# EasyEDA Pro project ProProject_基于STM32的Buck-Boost型数字电源_2024-06-04.epro, schematic Schematic1

## Sheets
1 P1: Create Date: 2023-12-06; Page Name: P1; Project Name: 基于STM32的Buck-Boost型数字电源; Schematic Name: Schematic1; Update Date: 2023-12-06; Company: 嘉立创EDA; Page Size: A4; Version: V1.0
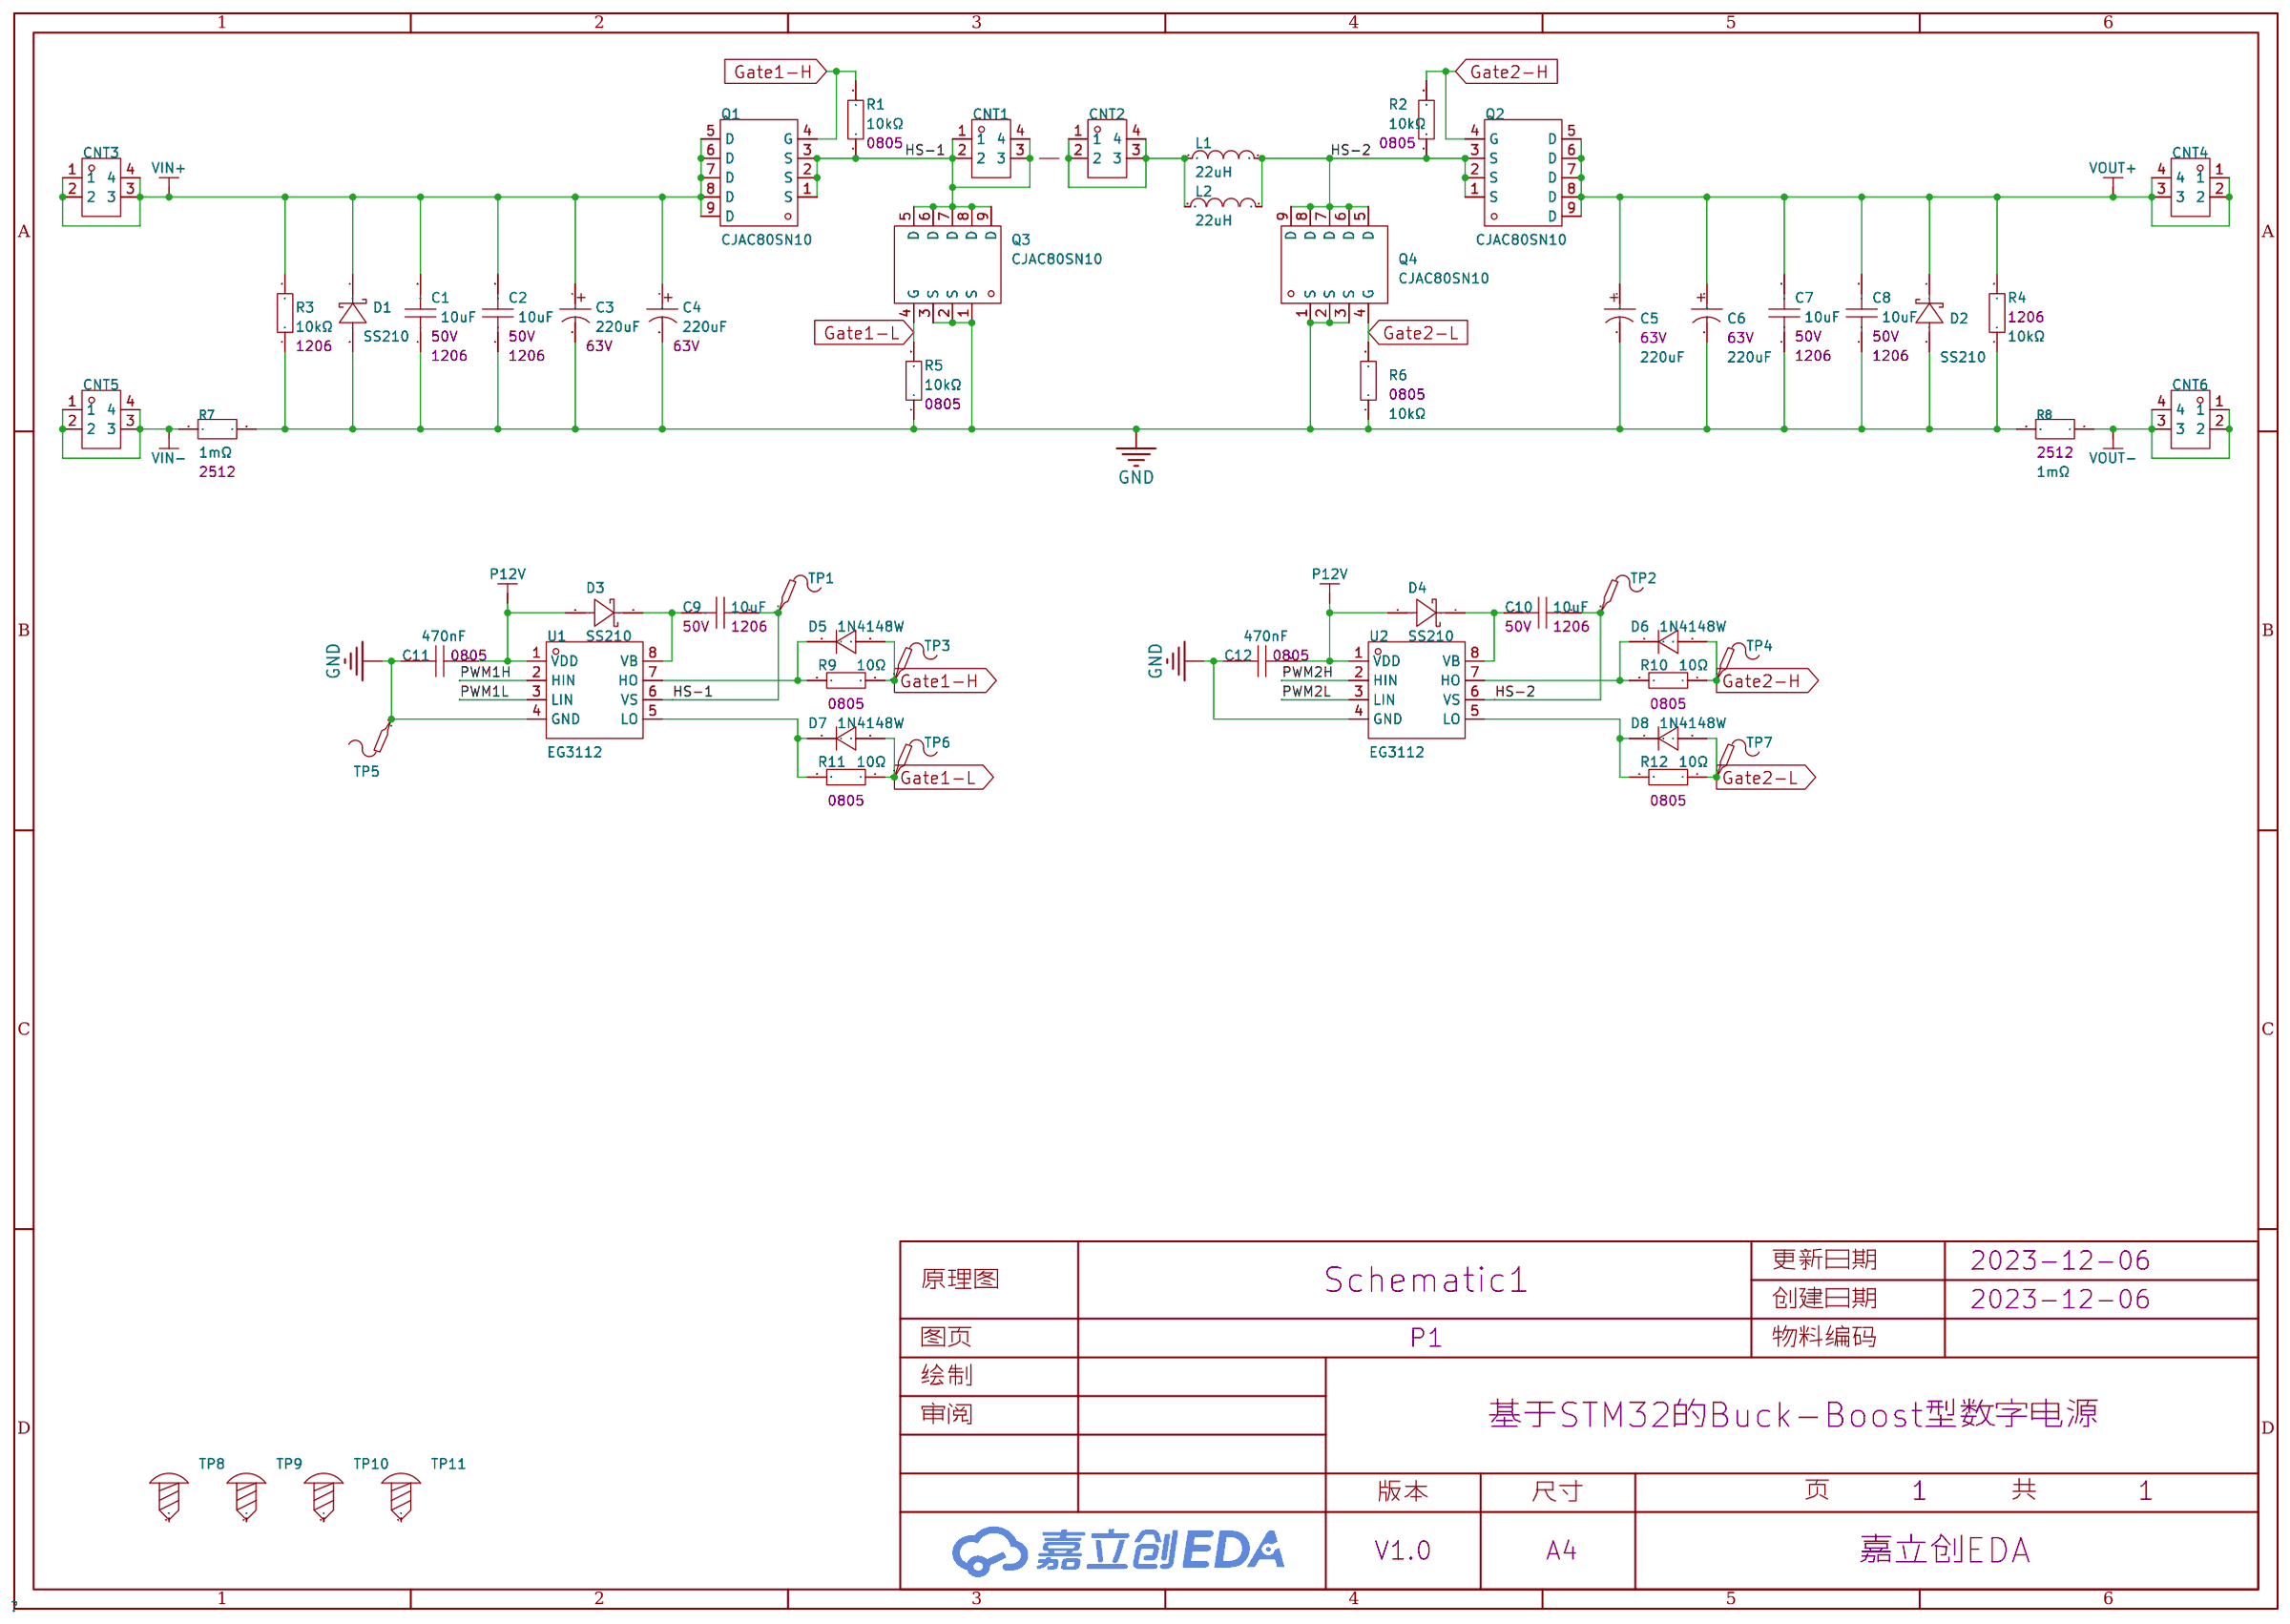
[diagram p0: P1]
2 P2: Create Date: 2024-01-31; Page Name: P2; Update Date: 2024-01-31
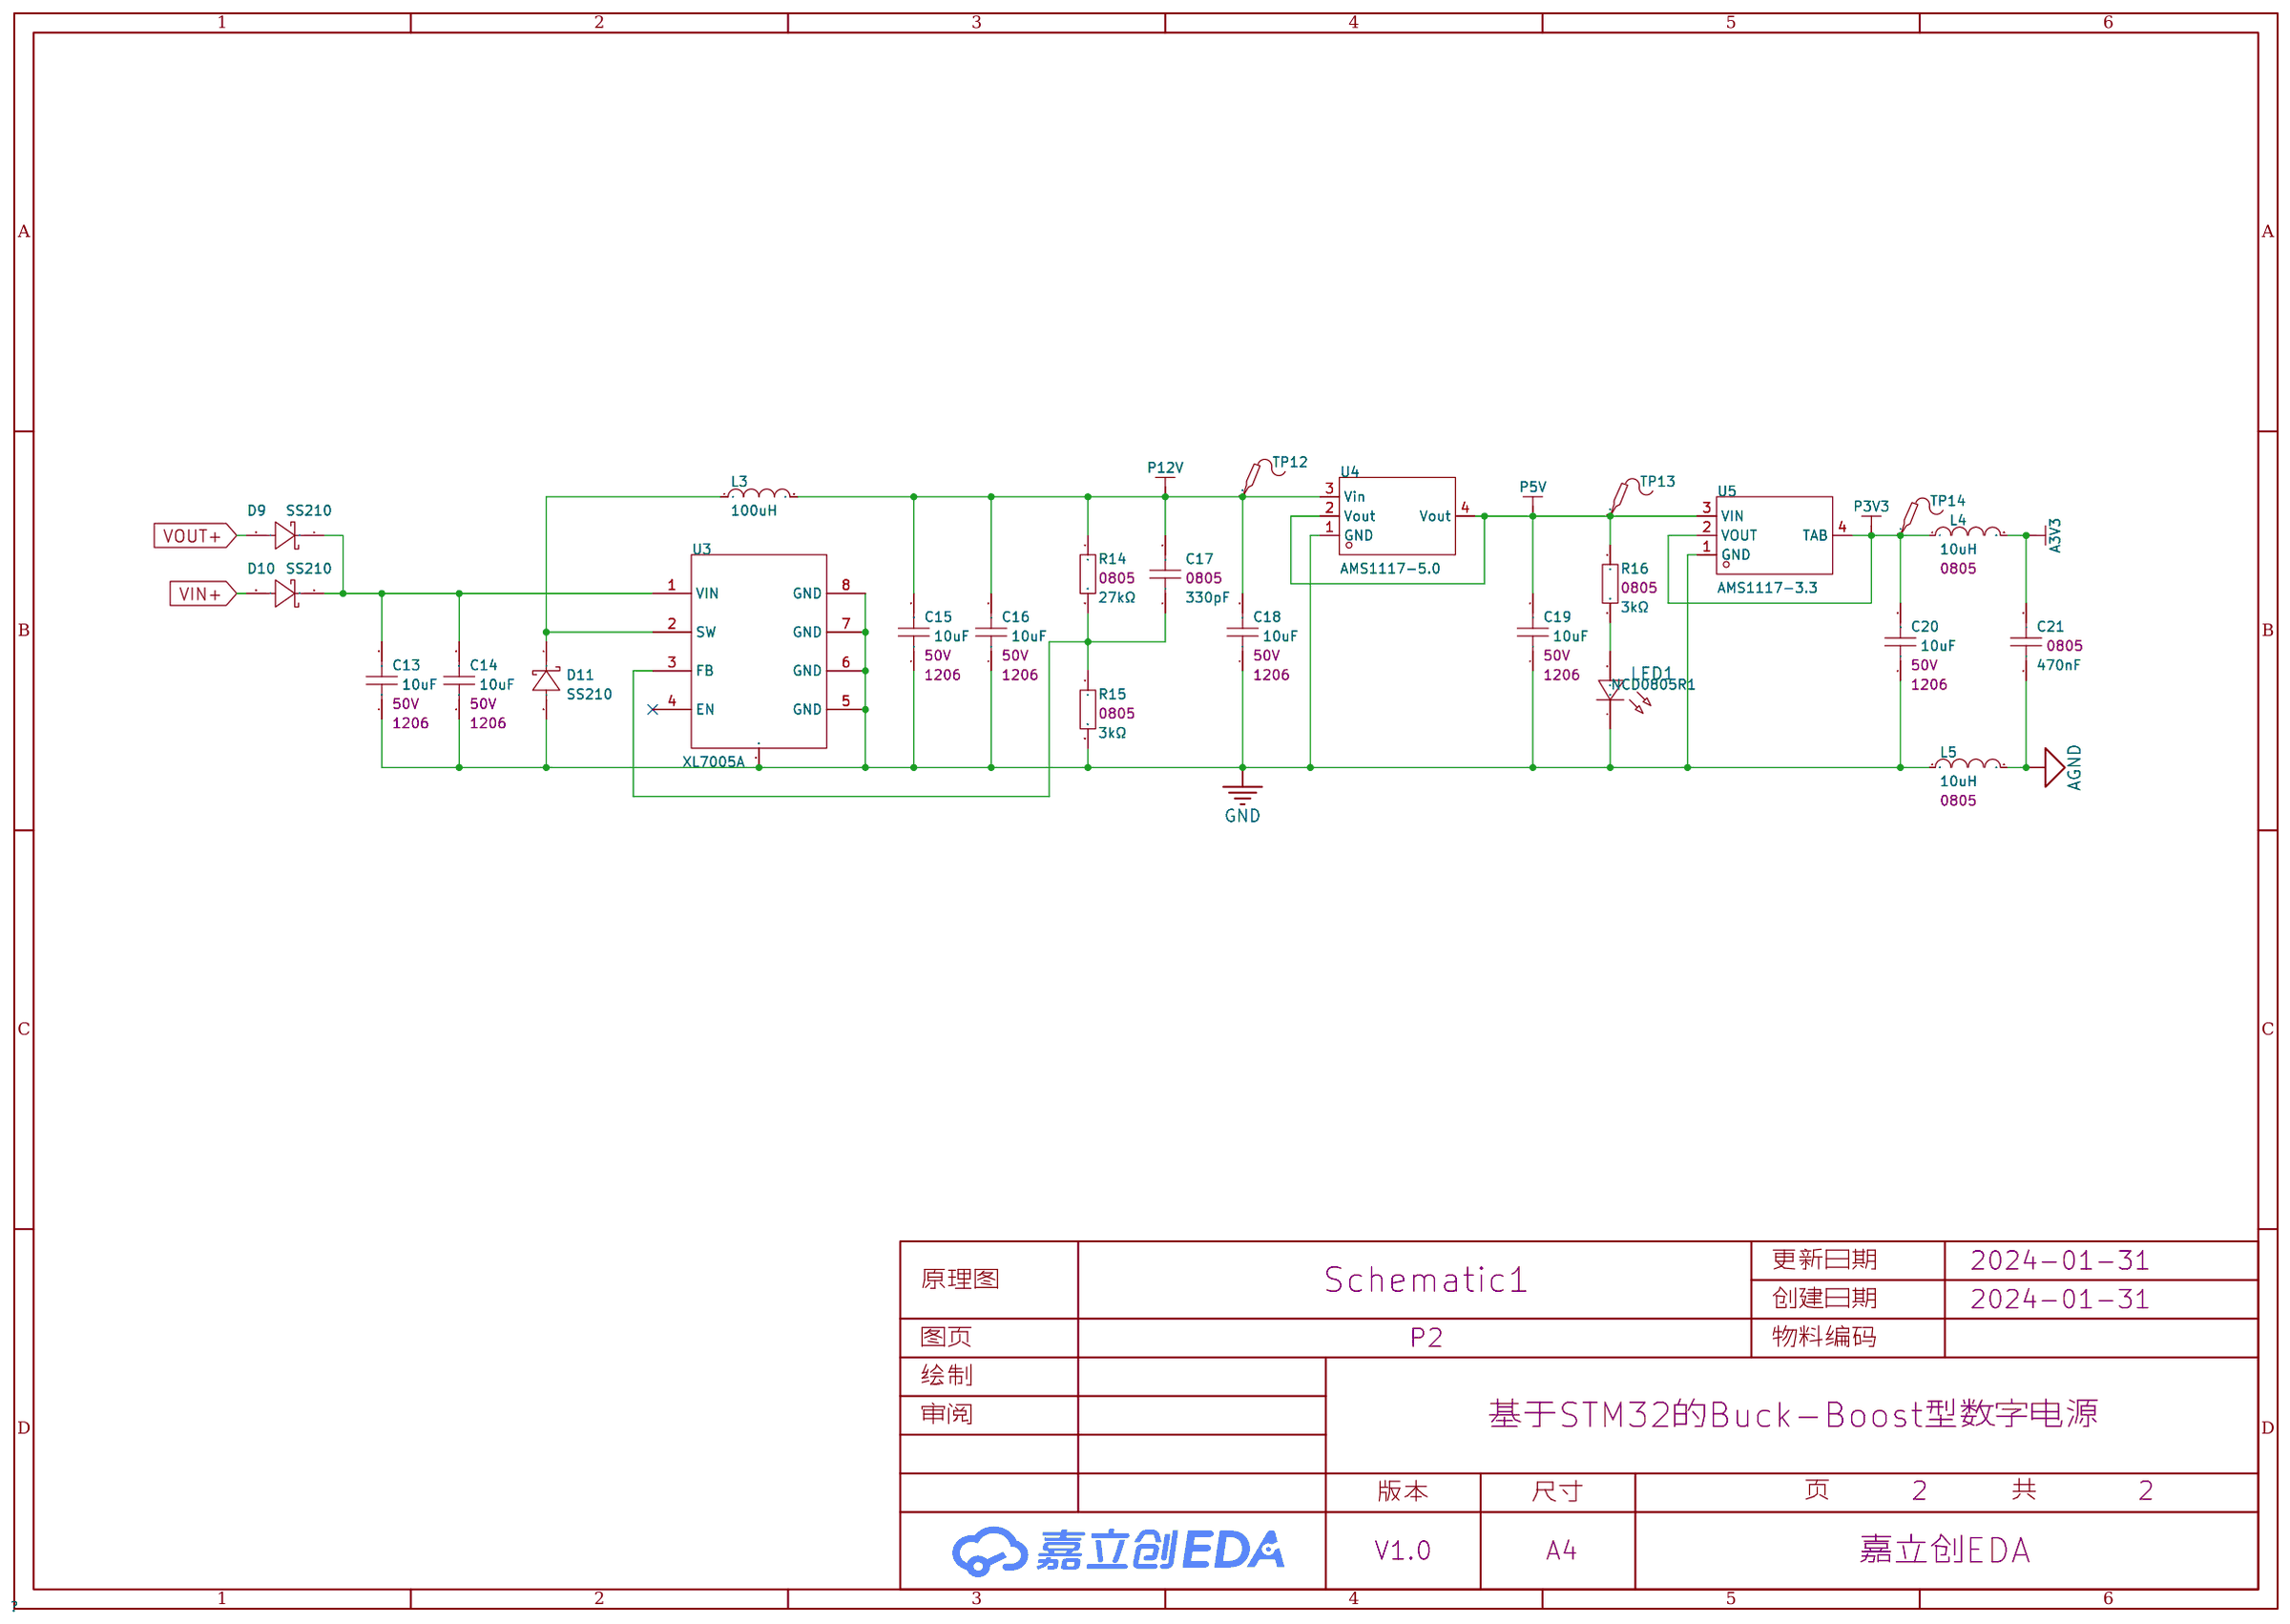
[diagram p1: P2]
3 P3: Create Date: 2024-01-31; Page Name: P3; Update Date: 2024-01-31
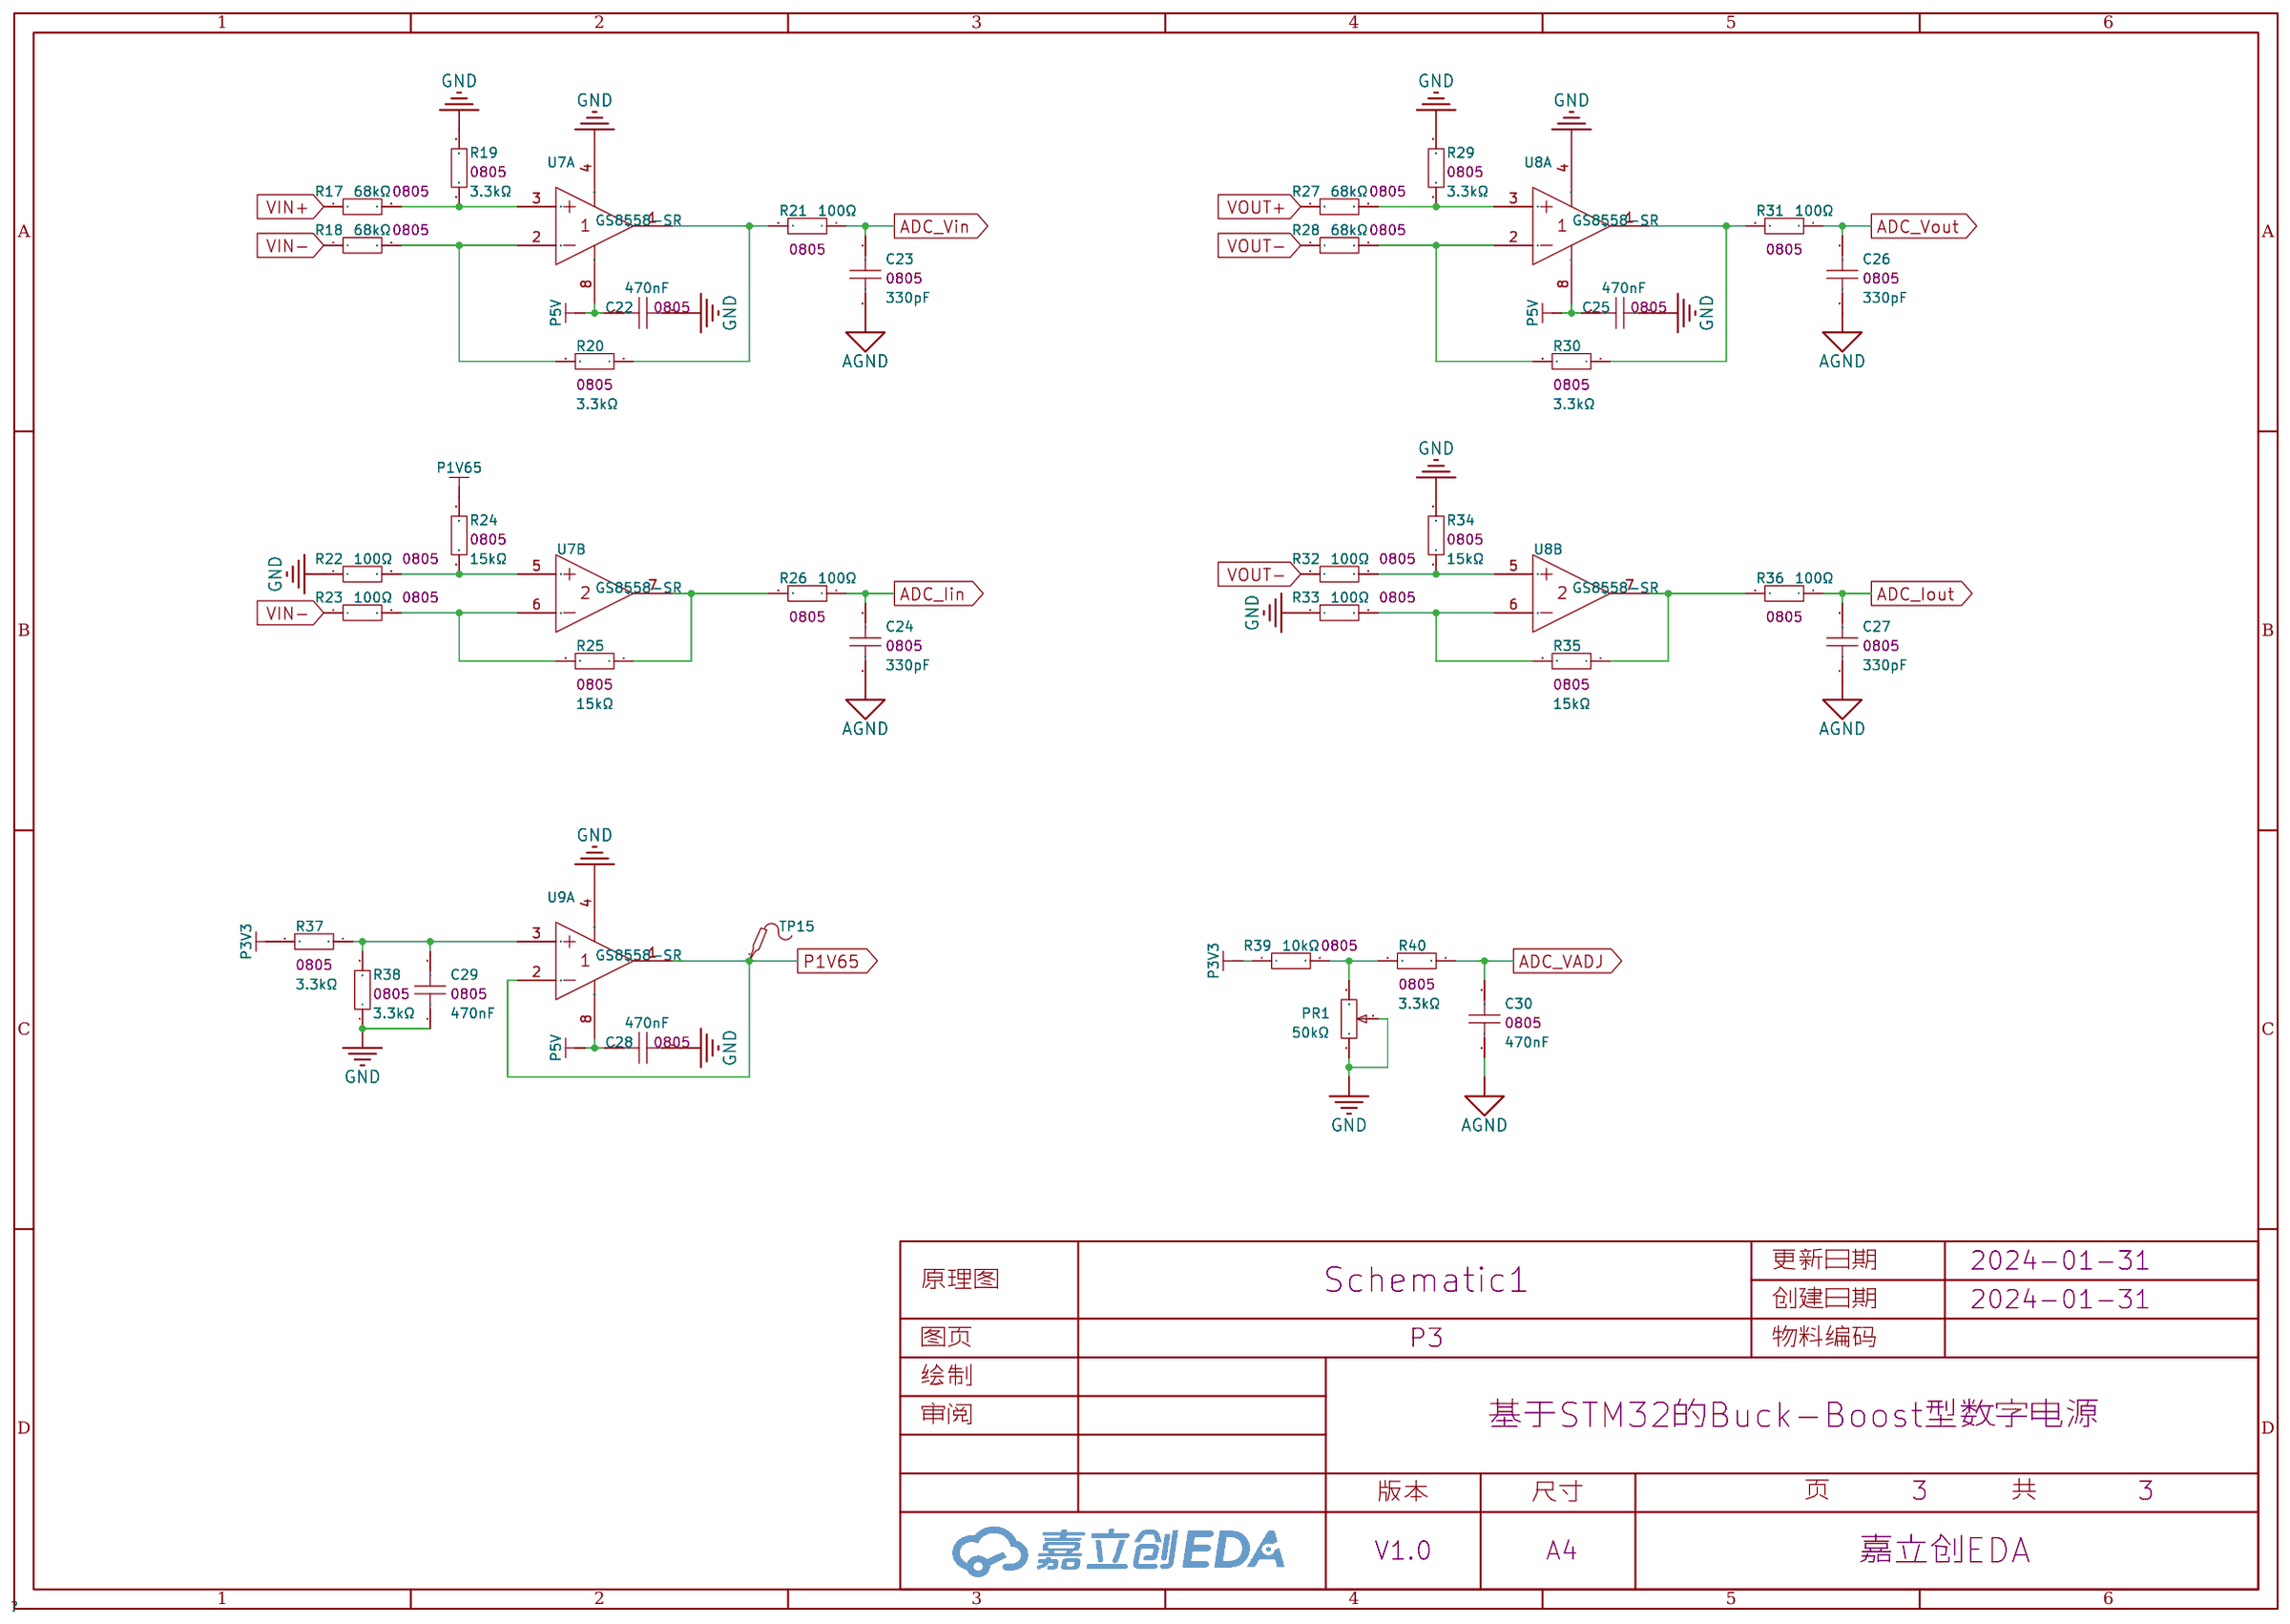
[diagram p2: P3]
4 P4: Create Date: 2024-01-31; Page Name: P4; Update Date: 2024-01-31
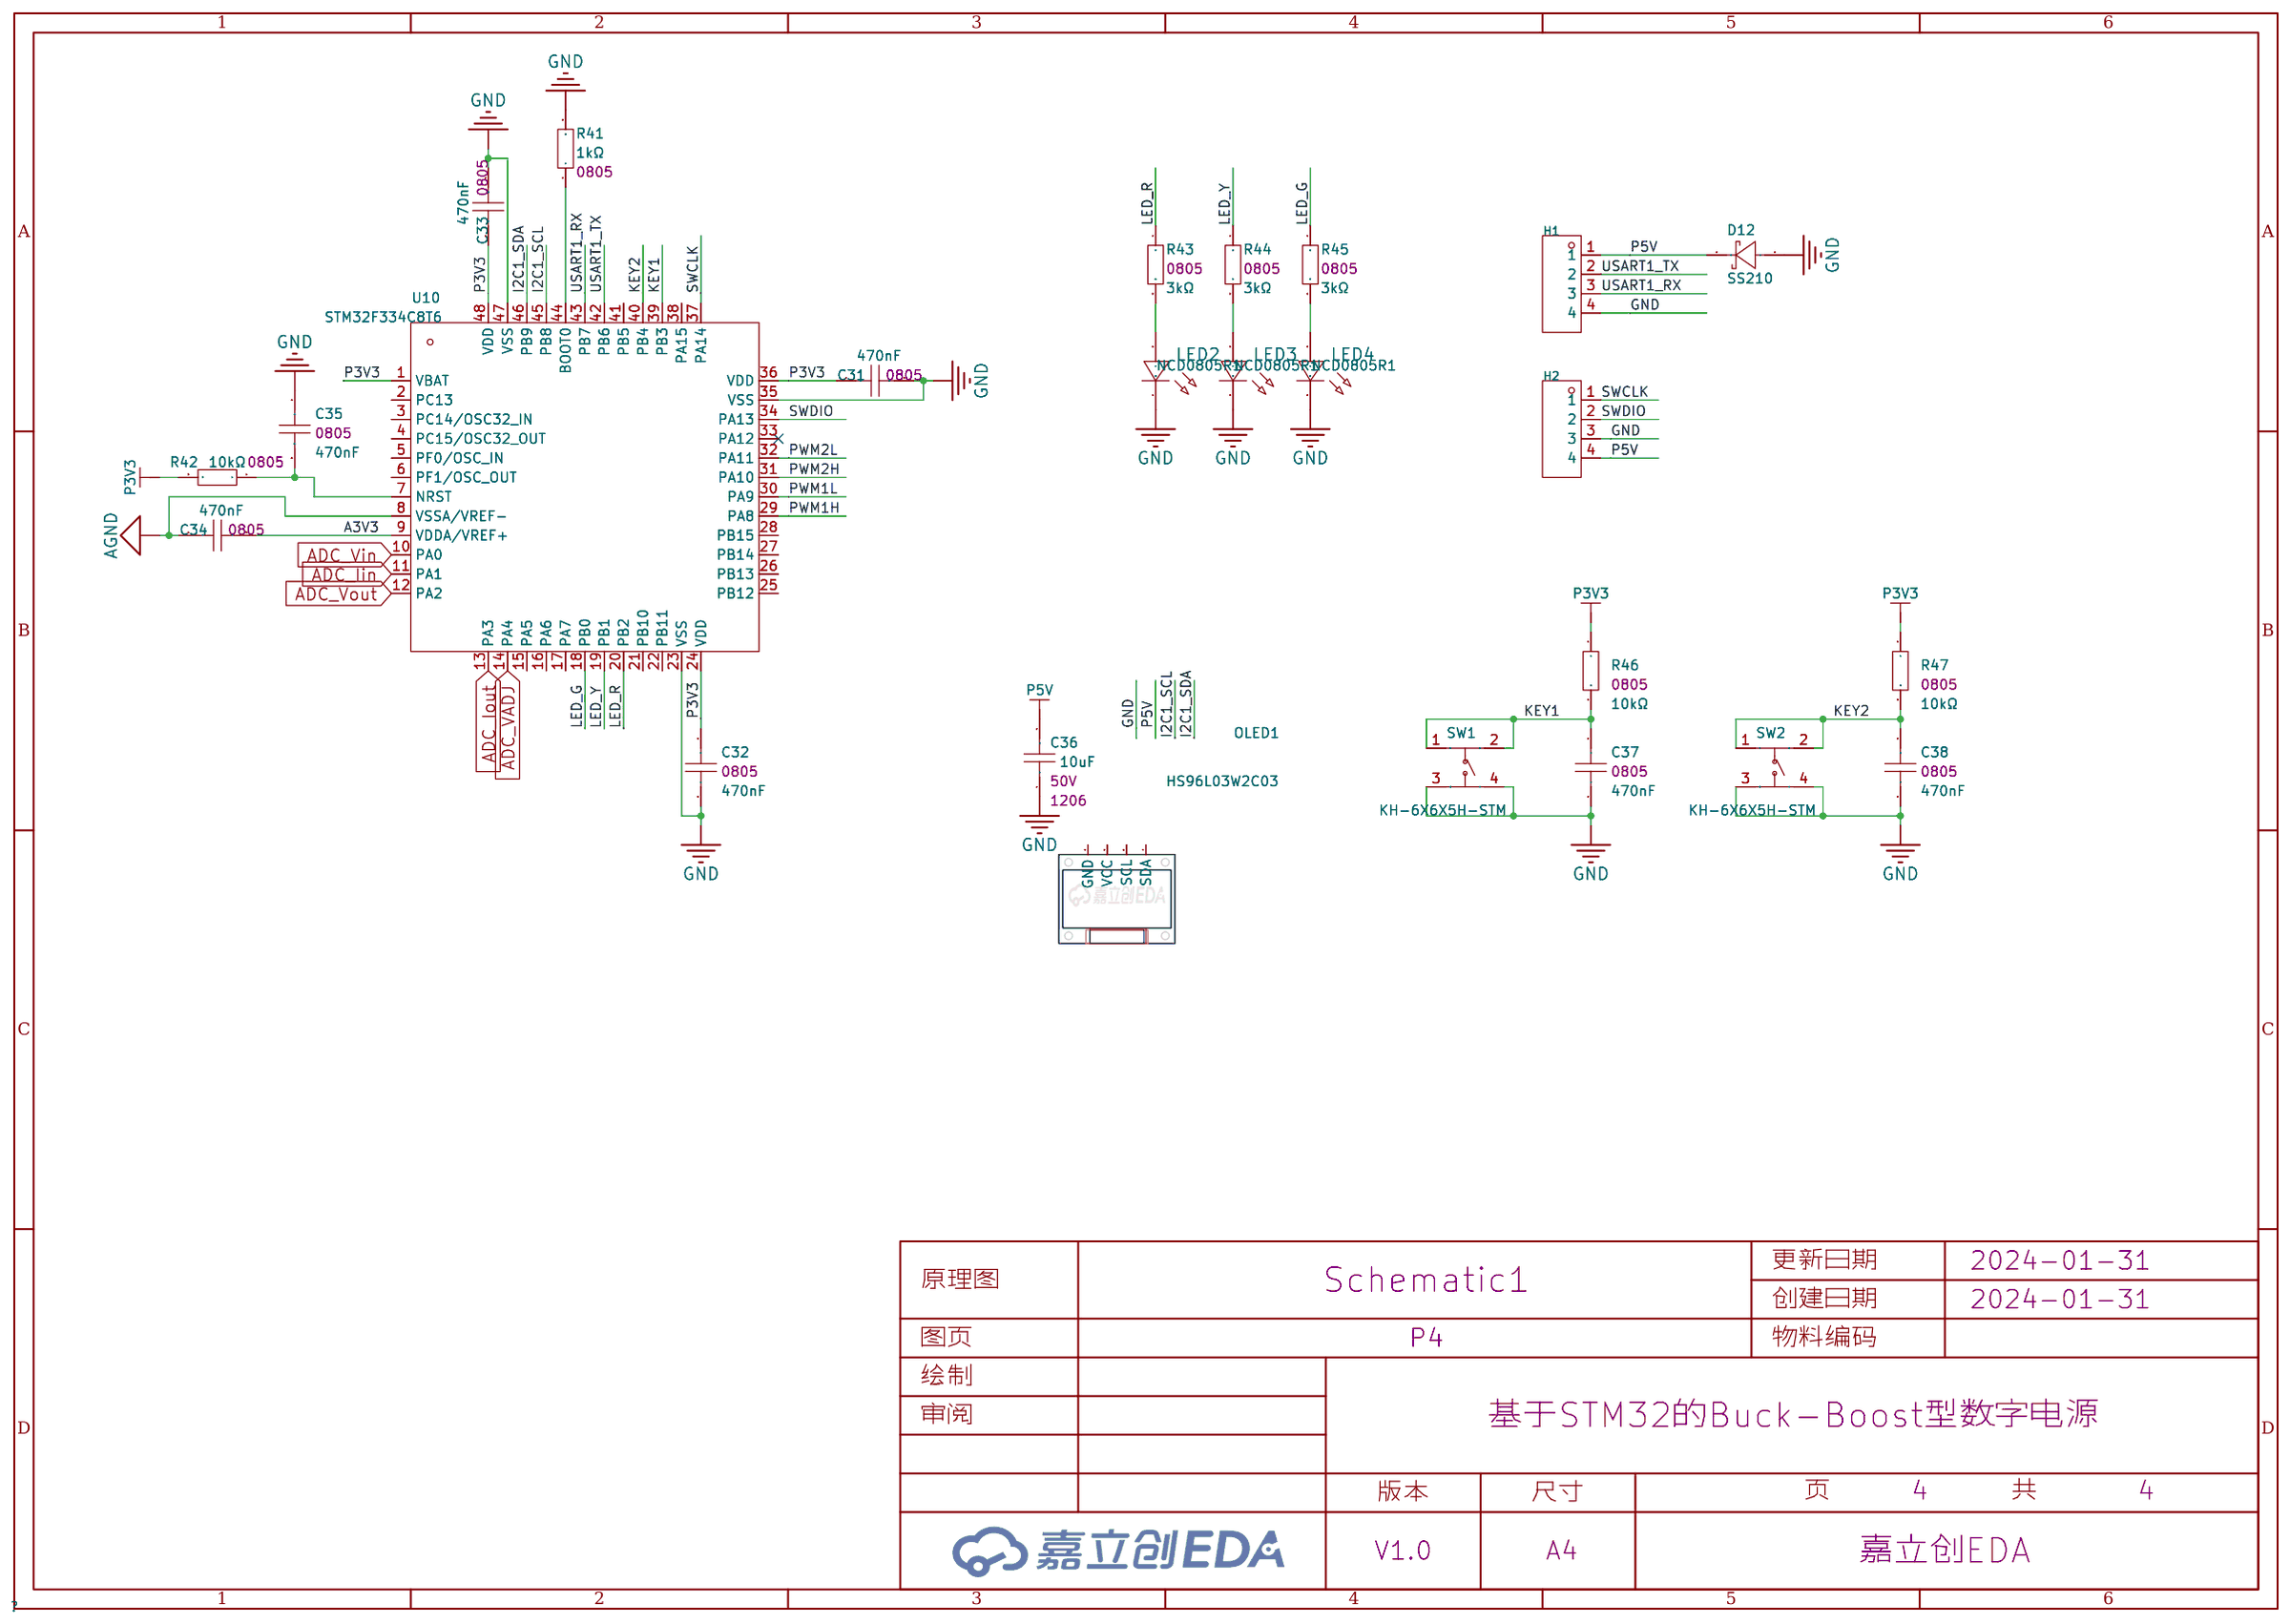
[diagram p3: P4]

## Parts
sheet P1
C1  10uF  [C1206]
C2  10uF  [C1206]
C3  220uF  [CAP-TH_BD10.0-P5.00-D1.0-FD]
C4  220uF  [CAP-TH_BD10.0-P5.00-D1.0-FD]
C5  220uF  [CAP-TH_BD10.0-P5.00-D1.0-FD]
C6  220uF  [CAP-TH_BD10.0-P5.00-D1.0-FD]
C7  10uF  [C1206]
C8  10uF  [C1206]
C9  10uF  [C1206]
C10  10uF  [C1206]
C11  470nF  [C0805]
C12  470nF  [C0805]
CNT1  T34001  [CONN-TH_T34001]
CNT2  T34001  [CONN-TH_T34001]
CNT3  T34001  [CONN-TH_T34001]
CNT4  T34001  [CONN-TH_T34001]
CNT5  T34001  [CONN-TH_T34001]
CNT6  T34001  [CONN-TH_T34001]
D1  SS210  [SMA_L4.3-W2.6-LS5.0-RD]
D2  SS210  [SMA_L4.3-W2.6-LS5.0-RD]
D3  SS210  [SMA_L4.3-W2.6-LS5.0-RD]
D4  SS210  [SMA_L4.3-W2.6-LS5.0-RD]
D5  1N4148W  [SOD-123_L2.8-W1.8-LS3.7-RD]
D6  1N4148W  [SOD-123_L2.8-W1.8-LS3.7-RD]
D7  1N4148W  [SOD-123_L2.8-W1.8-LS3.7-RD]
D8  1N4148W  [SOD-123_L2.8-W1.8-LS3.7-RD]
L1  22uH  [IND-TH_L29.0-W12.0-P10.00]
L2  22uH  [IND-SMD_L13.5-W12.6_XR_XR1265]
Q1  CJAC80SN10  [PDFN-8_L5.8-W5.0-P1.27-LS6.0-BL]
Q2  CJAC80SN10  [PDFN-8_L5.8-W5.0-P1.27-LS6.0-BL]
Q3  CJAC80SN10  [PDFN-8_L5.8-W5.0-P1.27-LS6.0-BL]
Q4  CJAC80SN10  [PDFN-8_L5.8-W5.0-P1.27-LS6.0-BL]
R1  10kΩ  [R0805]
R2  10kΩ  [R0805]
R3  10kΩ  [R1206]
R4  10kΩ  [R1206]
R5  10kΩ  [R0805]
R6  10kΩ  [R0805]
R7  1mΩ  [RES-SMD_L6.4-W3.2-A]
R8  1mΩ  [RES-SMD_L6.4-W3.2-A]
R9  10Ω  [R0805]
R10  10Ω  [R0805]
R11  10Ω  [R0805]
R12  10Ω  [R0805]
TP1  -  [Test-Point-0.5mm]
TP2  -  [Test-Point-0.5mm]
TP3  -  [Test-Point-0.5mm]
TP4  -  [Test-Point-0.5mm]
TP5  -  [Test-Point-0.5mm]
TP6  -  [Test-Point-0.5mm]
TP7  -  [Test-Point-0.5mm]
TP8  -  [M3螺丝]
TP9  -  [M3螺丝]
TP10  -  [M3螺丝]
TP11  -  [M3螺丝]
U1  EG3112  [SOP-8_L5.0-W3.9-P1.27-LS6.0-BL]
U2  EG3112  [SOP-8_L5.0-W3.9-P1.27-LS6.0-BL]
sheet P2
C13  10uF  [C1206]
C14  10uF  [C1206]
C15  10uF  [C1206]
C16  10uF  [C1206]
C17  330pF  [C0805]
C18  10uF  [C1206]
C19  10uF  [C1206]
C20  10uF  [C1206]
C21  470nF  [C0805]
D9  SS210  [SMA_L4.3-W2.6-LS5.0-RD]
D10  SS210  [SMA_L4.3-W2.6-LS5.0-RD]
D11  SS210  [SMA_L4.3-W2.6-LS5.0-RD]
L3  100uH  [IND-SMD_L7.1-W6.6]
L4  10uH  [L0805]
L5  10uH  [L0805]
LED1  NCD0805R1  [LED_0805]
R14  27kΩ  [R0805]
R15  3kΩ  [R0805]
R16  3kΩ  [R0805]
TP12  -  [Test-Point-0.5mm]
TP13  -  [Test-Point-0.5mm]
TP14  -  [Test-Point-0.5mm]
U3  XL7005A  [SOIC-8_L4.9-W3.9-P1.27-LS6.0-BL-EP3.1-1]
U4  AMS1117-5.0  [SOT-223-4_L6.5-W3.5-P2.30-LS7.0-BR]
U5  AMS1117-3.3  [SOT-223-3_L6.5-W3.5-P3.05-LS7.0]
sheet P3
C22  470nF  [C0805]
C23  330pF  [C0805]
C24  330pF  [C0805]
C25  470nF  [C0805]
C26  330pF  [C0805]
C27  330pF  [C0805]
C28  470nF  [C0805]
C29  470nF  [C0805]
C30  470nF  [C0805]
PR1  50kΩ  [R_3296]
R17  68kΩ  [R0805]
R18  68kΩ  [R0805]
R19  3.3kΩ  [R0805]
R20  3.3kΩ  [R0805]
R21  100Ω  [R0805]
R22  100Ω  [R0805]
R23  100Ω  [R0805]
R24  15kΩ  [R0805]
R25  15kΩ  [R0805]
R26  100Ω  [R0805]
R27  68kΩ  [R0805]
R28  68kΩ  [R0805]
R29  3.3kΩ  [R0805]
R30  3.3kΩ  [R0805]
R31  100Ω  [R0805]
R32  100Ω  [R0805]
R33  100Ω  [R0805]
R34  15kΩ  [R0805]
R35  15kΩ  [R0805]
R36  100Ω  [R0805]
R37  3.3kΩ  [R0805]
R38  3.3kΩ  [R0805]
R39  10kΩ  [R0805]
R40  3.3kΩ  [R0805]
TP15  -  [Test-Point-0.5mm]
U7  GS8558-SR  [SOIC-8_L4.9-W3.8-P1.27-LS6.0-BL]  (sections 1,2)
U8  GS8558-SR  [SOIC-8_L4.9-W3.8-P1.27-LS6.0-BL]  (sections 1,2)
U9  GS8558-SR  [SOIC-8_L4.9-W3.8-P1.27-LS6.0-BL]  (section 1)
sheet P4
C31  470nF  [C0805]
C32  470nF  [C0805]
C33  470nF  [C0805]
C34  470nF  [C0805]
C35  470nF  [C0805]
C36  10uF  [C1206]
C37  470nF  [C0805]
C38  470nF  [C0805]
D12  SS210  [SMA_L4.3-W2.6-LS5.0-RD]
H1  -  [HDR-TH_4P-P2.54-V-M]
H2  -  [HDR-TH_4P-P2.54-V-M]
LED2  NCD0805R1  [LED_0805]
LED3  NCD0805R1  [LED_0805]
LED4  NCD0805R1  [LED_0805]
OLED1  HS96L03W2C03  [0.96OLED_4P]
R41  1kΩ  [R0805]
R42  10kΩ  [R0805]
R43  3kΩ  [R0805]
R44  3kΩ  [R0805]
R45  3kΩ  [R0805]
R46  10kΩ  [R0805]
R47  10kΩ  [R0805]
SW1  KH-6X6X5H-STM  [SW-SMD_4P-L6.0-W6.0-P4.50-LS9.0-2]
SW2  KH-6X6X5H-STM  [SW-SMD_4P-L6.0-W6.0-P4.50-LS9.0-2]
U10  STM32F334C8T6  [LQFP-48_L7.0-W7.0-P0.50-LS9.0-BL]

## Library data of the parts
C1 C2 C7-C10 C13-C16 C18-C20 C36 = CS3216X5R106K500NRI: 容值:10uF;精度:±10%;额定电压:50V;材质(温度系数):X5R;; LCSC Part Name: 10uF ±10% 50V; Supplier Part: C513774; Manufacturer: SAMWHA(三和); Supplier Footprint: 1206; JLCPCB Part Class: Extended Part; Datasheet: https://atta.szlcsc.com/upload/public/pdf/source/20200519/C513774_8E6AF19D7056FD60653684FA0E0AD594.pdf; Supplier: LCSC; Tolerance: ±10%; Voltage Rated: 50V; Temperature Coefficient: X5R; 额定电压: 50V
C3-C6 = KM221M063G160A: 容值:220uF;精度:±20%;额定电压:63V;; LCSC Part Name: 220uF ±20% 63V; Supplier Part: C59391; Manufacturer: CapXon(丰宾); Supplier Footprint: 插件,D10xL16mm; JLCPCB Part Class: 扩展库; Datasheet: https://atta.szlcsc.com/upload/public/pdf/source/20150922/1457707409519.pdf; Supplier: LCSC; Tolerance: ±20%; Rated Voltage: 63V; Lead Spacing: 5mm; φD: 10mm; L: 16mm; Lifetime @ Temp: 2000hrs@105℃
C11 C12 C21 C22 C25 C28-C35 C37 C38 = CL21B474KBFNNNE: 容值:470nF;精度:±10%;额定电压:50V;材质(温度系数):X7R;; LCSC Part Name: 470nF ±10% 50V; Supplier Part: C13967; Manufacturer: SAMSUNG(三星); Supplier Footprint: 0805; JLCPCB Part Class: Basic Part; Datasheet: https://atta.szlcsc.com/upload/public/pdf/source/20160218/1457707763339.pdf; Supplier: LCSC; Tolerance: ±10%; Voltage Rated: 50V; Temperature Coefficient: X7R
CNT1-CNT6 = T34001: LCSC Part Name: 四脚 M3 二件套; Supplier Part: C481448; Manufacturer: XFCN(兴飞); Supplier Footprint: 插件; JLCPCB Part Class: 扩展库; Datasheet: https://atta.szlcsc.com/upload/public/pdf/source/20200107/C481448_4214B4EB74A46B70BD82BA8A456D4EDD.pdf; Supplier: LCSC
D1-D4 D9-D12 = SS210_C727058: 二极管配置:独立式;正向压降(Vf):850mV@2A;直流反向耐压(Vr):100V;平均整流电流(Io):2A;; LCSC Part Name: 电压:100V 电流:2A; Supplier Part: C727058; Manufacturer: TWGMC(台湾迪嘉); Supplier Footprint: SMA(DO-214AC); JLCPCB Part Class: 扩展库; Datasheet: https://atta.szlcsc.com/upload/public/pdf/source/20200828/C727054_EBD9B2B54EBE39BF61745E2EDC761F65.pdf; Supplier: LCSC; Diode Configuration: 独立式; Forward Voltage (Vf@If): 850mV@2A; Reverse Voltage (Vr): 100V; Average Rectified Current (Io): 2A; Reverse Leakage Current (Ir): 500uA@100V
D5-D8 = 1N4148W_C2099: 二极管配置:独立式;正向压降(Vf):1.25V@150mA;直流反向耐压(Vr):100V;平均整流电流(Io):150mA;功率:500mW;反向恢复时间(trr):4ns;; LCSC Part Name: 电压:100V 电流:150mA; Supplier Part: C2099; Manufacturer: CJ(江苏长电/长晶); Supplier Footprint: SOD-123; JLCPCB Part Class: Extended Part; Datasheet: https://atta.szlcsc.com/upload/public/pdf/source/20120428/1457706480199.pdf; Supplier: LCSC; Diode Configuration: 独立式; Forward Voltage (Vf@If): 1.25V@150mA; Reverse Voltage (Vr): 100V; Average Rectified Current (Io): 150mA; Power Dissipation: 500mW; Reverse Leakage Current: 1uA@75V; Reverse Recovery Time (trr): 4ns
L1 = SLT092125T220MTB: 电感值:22uH;精度:±20%;额定电流:-;饱和电流(Isat):-;类型:磁环电感;Q值:-;; LCSC Part Name: 磁环电感 22uH ±20%; Supplier Part: C908344; Manufacturer: Sunltech(韩国顺磁); Supplier Footprint: 插件; JLCPCB Part Class: 扩展库; Datasheet: https://atta.szlcsc.com/upload/public/pdf/source/20201022/C908344_03602A2FED0D50CD4A737DC769BB14A8.pdf; Supplier: LCSC; Tolerance: ±20%; DC Resistance: 20mΩ; Type: 磁环电感
L2 = XR1265-220M: 电感值:22uH;精度:±20%;额定电流:7A;; LCSC Part Name: 22uH ±20%; Supplier Part: C5339470; Manufacturer: XR(祥如); Supplier Footprint: SMD,1265; JLCPCB Part Class: 扩展库; Datasheet: https://atta.szlcsc.com/upload/public/pdf/source/20221228/8F25018F537F239E81AF9D59F9CE91EF.pdf; Supplier: LCSC; Tolerance: ±20%; Rated Current: 7A; DC Resistance (DCR): 39.5mΩ
Q1-Q4 = CJAC80SN10: 类型:N沟道;漏源电压(Vdss):100V;连续漏极电流(Id):80A;功率(Pd):100W;导通电阻(RDS(on)@Vgs,Id):6.2mΩ@10V;阈值电压(Vgs(th)@Id):2.5V;; LCSC Part Name: N沟道 耐压:100V 电流:80A; Supplier Part: C2913221; Manufacturer: CJ(江苏长电/长晶); Supplier Footprint: PDFN-8(5x6); JLCPCB Part Class: 扩展库; Datasheet: https://atta.szlcsc.com/upload/public/pdf/source/20211101/4F9ADD6ECF58ED50A240A9902BC9A3EC.pdf; Supplier: LCSC; Type: N沟道; Drain Source Voltage (Vdss): 100V; Continuous Drain Current (Id): 80A; Power Dissipation (Pd): 100W; Drain Source On Resistance (RDS(on)@Vgs,Id): 6.2mΩ@10V; Gate Threshold Voltage (Vgs(th)@Id): 2.5V; Total Gate Charge (Qg@Vgs): 46nC; Input Capacitance (Ciss@Vds): 2.2nF; Reverse Transfer Capacitance (Crss@Vds): 6.3pF; Operating Temperature: -55℃~+150℃@(Tj)
R1 R2 R5 R6 R39 R42 R46 R47 = 0805W8F1002T5E_C17414: 阻值:10kΩ;精度:±1%;功率:125mW;温度系数:±100ppm/℃;电阻类型:厚膜电阻;; LCSC Part Name: 10kΩ ±1% 125mW 厚膜电阻; Supplier Part: C17414; Manufacturer: UNI-ROYAL(厚声); Manufacturer Part: 0805W8F1002T5E; Supplier Footprint: 0805; JLCPCB Part Class: Basic Part; Datasheet: https://atta.szlcsc.com/upload/public/pdf/source/20200306/C422600_1E6D84923E4A46A82E41ADD87F860B5C.pdf; Supplier: LCSC; Tolerance: ±1%; Power(Watts): 125mW; Overload Voltage (Max): 150V; Temperature Coefficient: ±100ppm/℃; Type: 厚膜电阻; Operating Temperature Range: -55℃~+155℃
R3 R4 = 1206W4F1002T5E: 阻值:10kΩ;精度:±1%;功率:250mW;温度系数:±100ppm/℃;电阻类型:厚膜电阻;; LCSC Part Name: 10kΩ ±1% 250mW 厚膜电阻; Supplier Part: C17902; Manufacturer: UNI-ROYAL(厚声); Supplier Footprint: 1206; JLCPCB Part Class: Basic Part; Datasheet: https://atta.szlcsc.com/upload/public/pdf/source/20200306/C422600_1E6D84923E4A46A82E41ADD87F860B5C.pdf; Supplier: LCSC; Tolerance: ±1%; Power(Watts): 250mW; Overload Voltage (Max): 200V; Temperature Coefficient: ±100ppm/℃; Type: 厚膜电阻; Operating Temperature Range: -55℃~+155℃
R7 R8 = PA2512FKE7T0R001E: 阻值:1mΩ;精度:±1%;功率:3W;温度系数:±50ppm/℃;; LCSC Part Name: 1mΩ ±1% 3W; Supplier Part: C728297; Manufacturer: YAGEO(国巨); Supplier Footprint: 2512; JLCPCB Part Class: 扩展库; Datasheet: https://atta.szlcsc.com/upload/public/pdf/source/20200824/C728297_20EB0FFB6E82CC9A33DA0D0A8D7B30A2.pdf; Supplier: LCSC; Tolerance: ±1%; Power(Watts): 3W; Temperature Coefficient: ±50ppm/℃; Operating Temperature Range: -55℃~+170℃
R9-R12 = 0805W8F100JT5E: 阻值:10Ω;精度:±1%;功率:125mW;温度系数:±200ppm/℃;电阻类型:厚膜电阻;; LCSC Part Name: 10Ω ±1% 125mW 厚膜电阻; Supplier Part: C17415; Manufacturer: UNI-ROYAL(厚声); Supplier Footprint: 0805; JLCPCB Part Class: Basic Part; Datasheet: https://atta.szlcsc.com/upload/public/pdf/source/20200306/C422600_1E6D84923E4A46A82E41ADD87F860B5C.pdf; Supplier: LCSC; Tolerance: ±1%; Power(Watts): 125mW; Overload Voltage (Max): 150V; Temperature Coefficient: ±200ppm/℃; Type: 厚膜电阻; Operating Temperature Range: -55℃~+155℃
TP1-TP7 TP12-TP15 = Test-Point: Test Point 测试点
TP8-TP11 = M3螺丝: Supplier Footprint: 插件
U1 U2 = EG3112: 600V，IO+1A/-1.5A，大功率MOS管、IGBT管栅极驱动IC; Supplier Part: C111908; Manufacturer: EG(屹晶微); Supplier Footprint: SOIC-8; JLCPCB Part Class: Extended Part; Datasheet: https://atta.szlcsc.com/upload/public/pdf/source/20230725/3992D5BD05E91E0CBB5D3EE72F4B3B26.pdf; Supplier: LCSC
C17 C23 C24 C26 C27 = CL21B331KBANNNC: 容值:330pF;精度:±10%;额定电压:50V;材质(温度系数):X7R;; LCSC Part Name: 330pF ±10% 50V 停产; Supplier Part: C51207; Manufacturer: SAMSUNG(三星); Supplier Footprint: 0805; JLCPCB Part Class: Extended Part; Datasheet: https://atta.szlcsc.com/upload/public/pdf/source/20160218/1457707763339.pdf; Supplier: LCSC; Tolerance: ±10%; Voltage Rated: 50V; Temperature Coefficient: X7R
L3 = SMMS0650-101M: 类型:一体成型电感;电感值:100uH;精度:±20%;额定电流:1.5A;饱和电流(Isat):2A;; LCSC Part Name: 100uH ±20% 2A; Supplier Part: C2894722; Manufacturer: SXN(顺翔诺); Supplier Footprint: SMD,6.6x7.1mm; JLCPCB Part Class: 扩展库; Datasheet: https://atta.szlcsc.com/upload/public/pdf/source/20210910/523B6BB0C4A09F37806A127B1ABE761D.pdf; Supplier: LCSC; Type: 一体成型电感; Tolerance: ±20%; Rated Current: 1.5A; Saturation Current (Isat): 2A; DC Resistance (DCR): 720mΩ
L4 L5 = SDFL2012S100KTF: 电感值:10uH;精度:±10%;额定电流:15mA;饱和电流(Isat):-;直流电阻(DCR):1.15Ω;; LCSC Part Name: 10uH ±10%; Supplier Part: C1046; Manufacturer: Sunlord(顺络); Supplier Footprint: 0805; JLCPCB Part Class: 基础库; Datasheet: https://atta.szlcsc.com/upload/public/pdf/source/20210816/855F4348312D259031B87CBCF31BE802.pdf; Supplier: LCSC; Tolerance: ±10%; Rated Current: 15mA; DC Resistance (DCR): 1.15Ω
LED1-LED4 = NCD0805R1: 灯头类型:-;发光颜色:红色;正向电压(VF):1.6V~2.6V;功率:65mW;正向电流:20mA;主波长:615nm~630nm;二极管配置:独立二极管;透镜颜色:无色透明;色温:-;发光强度:67mcd~195mcd;发光角度:130°;载带方式:-;工作温度:-30℃~+85℃;; Supplier Part: C84256; Manufacturer: 国星光电; Supplier Footprint: 0805; JLCPCB Part Class: Basic Part; Datasheet: https://atta.szlcsc.com/upload/public/pdf/source/20200820/C84256_F0A75A43B3EAD75808600A0514C76B99.pdf; Supplier: LCSC; Emitted Color: 红色; Forward Voltage (VF): 1.6V~2.6V; Power Dissipation: 65mW; Forward Current: 20mA; Dominant Wavelength: 615nm~630nm; Diode Configuration: 独立二极管; Lens Color: 无色透明; Luminous Intensity: 67mcd~195mcd; Viewing Angle: 130°; Operating Temperature: -30℃~+85℃
R14 = 0805W8F2702T5E: 阻值:27kΩ;精度:±1%;功率:125mW;温度系数:±100ppm/℃;电阻类型:厚膜电阻;; LCSC Part Name: 27kΩ ±1% 125mW 厚膜电阻; Supplier Part: C17593; Manufacturer: UNI-ROYAL(厚声); Supplier Footprint: 0805; JLCPCB Part Class: Basic Part; Datasheet: https://atta.szlcsc.com/upload/public/pdf/source/20200306/C422600_1E6D84923E4A46A82E41ADD87F860B5C.pdf; Supplier: LCSC; Tolerance: ±1%; Power(Watts): 125mW; Overload Voltage (Max): 150V; Temperature Coefficient: ±100ppm/℃; Type: 厚膜电阻; Operating Temperature Range: -55℃~+155℃
R15 R16 R43-R45 = 0805W8F3001T5E: 阻值:3kΩ;精度:±1%;功率:125mW;温度系数:±100ppm/℃;电阻类型:厚膜电阻;; LCSC Part Name: 3kΩ ±1% 125mW 厚膜电阻; Supplier Part: C17661; Manufacturer: UNI-ROYAL(厚声); Supplier Footprint: 0805; JLCPCB Part Class: Basic Part; Datasheet: https://atta.szlcsc.com/upload/public/pdf/source/20200306/C422600_1E6D84923E4A46A82E41ADD87F860B5C.pdf; Supplier: LCSC; Tolerance: ±1%; Power(Watts): 125mW; Overload Voltage (Max): 150V; Temperature Coefficient: ±100ppm/℃; Type: 厚膜电阻; Operating Temperature Range: -55℃~+155℃
U3 = XL7005A: 功能类型:降压型;同步整流:-;输出通道数:-;拓扑结构:-;输入电压:-;输出电流(最大值):-;开关频率:-;; LCSC Part Name: 降压型; Supplier Part: C50848; Manufacturer: XLSEMI(芯龙); Supplier Footprint: SOP-8-EP-150mil; JLCPCB Part Class: 扩展库; Datasheet: https://atta.szlcsc.com/upload/public/pdf/source/20150821/1457707346919.pdf; Supplier: LCSC; Function: 降压型
U4 = AMS1117-5.0_C5345984: 输出类型:固定;最大输入电压:18V;输出电压:5V;输出电流:1A;输出极性:正;; LCSC Part Name: 输入18V 输出5V 1A; Supplier Part: C5345984; Manufacturer: HXY MOSFET(华轩阳电子); Supplier Footprint: SOT-223; JLCPCB Part Class: 扩展库; Datasheet: https://atta.szlcsc.com/upload/public/pdf/source/20230112/E762ED9FBAA0859C5A1A23C5A68BE95D.pdf; Supplier: LCSC; Output Type: 固定; Maximum Input Voltage: 18V; Output Voltage: 5V; Output Current: 1A; Dropout Voltage: 1.4V@(1A); Output Polarity: 正; Number of Outputs: 1
U5 = AMS1117-3.3_C5250992: 输出类型：固定 输出极性：正 最大输入电压：18V 输出电压：3.3V 输出电流：1A 电源纹波抑制比(PSRR)：60dB@(120Hz)。当前应用较多领域：三端稳压器，机顶盒; Supplier Part: C5250992; Manufacturer: TWGMC(台湾迪嘉); Supplier Footprint: SOT-223-3L; JLCPCB Part Class: 扩展库; Datasheet: https://atta.szlcsc.com/upload/public/pdf/source/20221109/A58A92B07670E85D28928AE371260E8D.pdf; Supplier: LCSC
PR1 = 3296W-1-503: 阻值:50kΩ;精度:±10%;; LCSC Part Name: 50kΩ ±10%; Supplier Part: C118911; Manufacturer: BOCHEN(博晨); Supplier Footprint: 插件; JLCPCB Part Class: Extended Part; Datasheet: https://atta.szlcsc.com/upload/public/pdf/source/20171114/C118911_15106326557211117401.pdf; Supplier: LCSC; Tolerance: ±10%
R17 R18 R27 R28 = 0805W8F6802T5E: 阻值:68kΩ;精度:±1%;功率:125mW;温度系数:±100ppm/℃;电阻类型:厚膜电阻;; LCSC Part Name: 68kΩ ±1% 125mW 厚膜电阻; Supplier Part: C17801; Manufacturer: UNI-ROYAL(厚声); Supplier Footprint: 0805; JLCPCB Part Class: Basic Part; Datasheet: https://atta.szlcsc.com/upload/public/pdf/source/20200306/C422600_1E6D84923E4A46A82E41ADD87F860B5C.pdf; Supplier: LCSC; Tolerance: ±1%; Power(Watts): 125mW; Overload Voltage (Max): 150V; Temperature Coefficient: ±100ppm/℃; Type: 厚膜电阻; Operating Temperature Range: -55℃~+155℃
R19 R20 R29 R30 R37 R38 R40 = 0805W8F3301T5E: 阻值:3.3kΩ;精度:±1%;功率:125mW;温度系数:±100ppm/℃;电阻类型:厚膜电阻;; LCSC Part Name: 3.3kΩ ±1% 125mW 厚膜电阻; Supplier Part: C26010; Manufacturer: UNI-ROYAL(厚声); Supplier Footprint: 0805; JLCPCB Part Class: Basic Part; Datasheet: https://atta.szlcsc.com/upload/public/pdf/source/20200306/C422600_1E6D84923E4A46A82E41ADD87F860B5C.pdf; Supplier: LCSC; Tolerance: ±1%; Power(Watts): 125mW; Overload Voltage (Max): 150V; Temperature Coefficient: ±100ppm/℃; Type: 厚膜电阻; Operating Temperature Range: -55℃~+155℃
R21-R23 R26 R31-R33 R36 = 0805W8F1000T5E: 阻值:100Ω;精度:±1%;功率:125mW;温度系数:±100ppm/℃;电阻类型:厚膜电阻;; LCSC Part Name: 100Ω ±1% 125mW 厚膜电阻; Supplier Part: C17408; Manufacturer: UNI-ROYAL(厚声); Supplier Footprint: 0805; JLCPCB Part Class: Basic Part; Datasheet: https://atta.szlcsc.com/upload/public/pdf/source/20200306/C422600_1E6D84923E4A46A82E41ADD87F860B5C.pdf; Supplier: LCSC; Tolerance: ±1%; Power(Watts): 125mW; Overload Voltage (Max): 150V; Temperature Coefficient: ±100ppm/℃; Type: 厚膜电阻; Operating Temperature Range: -55℃~+155℃
R24 R25 R34 R35 = 0805W8F1502T5E: 阻值:15kΩ;精度:±1%;功率:125mW;温度系数:±100ppm/℃;电阻类型:厚膜电阻;; LCSC Part Name: 15kΩ ±1% 125mW 厚膜电阻; Supplier Part: C17475; Manufacturer: UNI-ROYAL(厚声); Supplier Footprint: 0805; JLCPCB Part Class: Basic Part; Datasheet: https://atta.szlcsc.com/upload/public/pdf/source/20200306/C422600_1E6D84923E4A46A82E41ADD87F860B5C.pdf; Supplier: LCSC; Tolerance: ±1%; Power(Watts): 125mW; Overload Voltage (Max): 150V; Temperature Coefficient: ±100ppm/℃; Type: 厚膜电阻; Operating Temperature Range: -55℃~+155℃
U7-U9 = GS8558-SR: 放大器数:双路;增益带宽积(GBP):13MHz;输入偏置电流(Ib):100pA;输入失调电压(Vos):5uV;压摆率(SR):8V/us;; Supplier Part: C2978613; Manufacturer: Gainsil(聚洵); Supplier Footprint: SOIC-8; JLCPCB Part Class: 扩展库; Datasheet: https://atta.szlcsc.com/upload/public/pdf/source/20220301/8E925AB8A777EC1CC32D65DB4BC8C388.pdf; Supplier: LCSC; Number of Circuits: 双路; Gain Bandwidth Product(GBP): 13MHz; Current - Input Bias(Ib): 100pA; Voltage - Input Offset(Vos): 5uV; Common Mode Rejection Ratio (CMRR): 100dB; Slew Rate(SR): 8V/us; Supply Voltage: 2.5V~5.5V; Output Current: 109mA; Input Offset Voltage Drift (Vos TC): 0.027uV/°C; Supply Current: 1.3mA; Operating Temperature: -40℃~+125℃
H1 H2 = HDR-M_2.54_1x4P: Supplier Part: C492403; Supplier Footprint: 插件
OLED1 = HS96L03W2C03: 主控芯片:SSD1315;接口类型:I2C;尺寸(inch):0.96;像素分辨率:128x64;; LCSC Part Name: 0.96寸OLED显示屏窄白光IIC; Supplier Part: C5248080; Manufacturer: HS(汉昇); JLCPCB Part Class: Extended Part; Datasheet: https://atta.szlcsc.com/upload/public/pdf/source/20230627/763D01F79A90007632F098068C7C8AD9.pdf; Supplier: LCSC; Main Control Chip: SSD1315; Interface Type: I2C; Size: 0.96; Pixel Resolution: 128x64; Operating Temperature: -40℃~+70℃
R41 = 0805W8F1001T5E: 阻值:1kΩ;精度:±1%;功率:125mW;温度系数:±100ppm/℃;电阻类型:厚膜电阻;; LCSC Part Name: 1kΩ ±1% 125mW 厚膜电阻; Supplier Part: C17513; Manufacturer: UNI-ROYAL(厚声); Supplier Footprint: 0805; JLCPCB Part Class: Basic Part; Datasheet: https://atta.szlcsc.com/upload/public/pdf/source/20200306/C422600_1E6D84923E4A46A82E41ADD87F860B5C.pdf; Supplier: LCSC; Tolerance: ±1%; Power(Watts): 125mW; Overload Voltage (Max): 150V; Temperature Coefficient: ±100ppm/℃; Type: 厚膜电阻; Operating Temperature Range: -55℃~+155℃
SW1 SW2 = KH-6X6X5H-STM: 电路结构:单刀单掷;带支架:否;触点电流:50mA;额定电压(DC):12V;安装方式:立贴;机械寿命:8万次;; LCSC Part Name: 6*6*5mm 立贴 轻触开关; Supplier Part: C2837531; Manufacturer: kinghelm(金航标); Supplier Footprint: SMD; JLCPCB Part Class: 扩展库; Datasheet: https://atta.szlcsc.com/upload/public/pdf/source/20210608/C2837531_45E87AB996CE723B09405FF2EA209C4C.pdf; Supplier: LCSC; Circuit: 单刀单掷; Actuator Style: 圆形按钮; Switch Length: 6mm; Switch Width: 6mm; Switch Height: 5mm; Strike Gundam: 否; Contact Current: 50mA; Voltage Rating (DC): 12V; Mounting Style: 立贴; Actuator/Cap Color: 黑色; Pin Style: 鸥翼型; Mechanical Life: 8万次
U10 = STM32F334C8T6: CPU内核:ARM Cortex-M4;CPU最大主频:72MHz;工作电压范围:2V~3.6V;内部振荡器:有;程序 FLASH容量:64K@x8bit;RAM总容量:12KB;EEPROM/数据 FLASH容量:-;GPIO端口数量:37;ADC(单元数/通道数/位数):1@x15ch/12bit;DAC(单元数/通道数/位数):1@x3ch/12bit;外设/功能/协议栈:DMA；看门狗；POR；PWM;工作温度范围:-40℃~+85℃;; LCSC Part Name: ARM Cortex-M4 72MHz 闪存：64K@x8bit RAM：12KB; Supplier Part: C99450; Manufacturer: ST(意法半导体); Supplier Footprint: LQFP-48(7x7); JLCPCB Part Class: 扩展库; Datasheet: https://atta.szlcsc.com/upload/public/pdf/source/20180105/C99450_15151501269081234225.pdf; Supplier: LCSC; CPU Core: ARM Cortex-M4; Maximum Frequency: 72MHz; Supply Voltage Range: 2V~3.6V; Internal Oscillator: 有; Program FLASH Size: 64K@x8bit; RAM Size: 12KB; GPIO Ports Number: 37; ADC (Units/Channels/bits): 1@x15ch/12bit; DAC (Units/Channels/bits): 1@x3ch/12bit; Peripherals / Functions / Protocol Stacks: DMA；看门狗；POR；PWM; Operating Temperature Range: -40℃~+85℃

## Nets
A3V3: C21.2 C34.2 L4.2 U10.9(VDDA/VREF+)
AGND: C21.1 C23.1 C24.1 C26.1 C27.1 C30.1 C34.1 L5.2 U10.8(VSSA/VREF-)
GND: C1.1 C2.1 C3.2 C4.2 C5.2 C6.2 C7.1 C8.1 C11.1 C12.1 C13.1 C14.1 C15.1 C16.1 C18.1 C19.1 C20.1 C22.2 C25.2 C28.2 C29.1 C31.2 C32.2 C33.2 C35.1 C36.1 C37.2 C38.2 D1.2(A) D2.2(A) D11.2(A) D12.2(A) H1.4 H2.3 L5.1 LED1.1(C) LED2.1(C) LED3.1(C) LED4.1(C) PR1.1 PR1.2 Q3.1(S) Q3.2(S) Q3.3(S) Q4.1(S) Q4.2(S) Q4.3(S) R3.1 R4.1 R5.1 R6.1 R7.2 R8.2 R15.2 R19.2 R22.1 R29.2 R33.1 R34.2 R38.1 R41.2 SW1.3 SW1.4 SW2.3 SW2.4 TP5.1 U1.4(GND) U2.4(GND) U3.5(GND) U3.6(GND) U3.7(GND) U3.8(GND) U3.9 U4.1(GND) U5.1(GND) U7.4(VSS) U8.4(VSS) U9.4(VSS) U10.23(VSS) U10.35(VSS) U10.47(VSS)
P1V65: R24.2 TP15.1 U9.1(OUTA) U9.2(-INA)
P3V3: C20.2 C31.1 C32.1 C33.1 L4.1 R37.2 R39.1 R42.2 R46.1 R47.1 TP14.1 U5.2(VOUT) U5.4(TAB) U10.1(VBAT) U10.24(VDD) U10.36(VDD) U10.48(VDD)
P5V: C19.2 C22.1 C25.1 C28.1 C36.2 D12.1(K) H1.1 H2.4 R16.1 TP13.1 U4.2(Vout) U4.4(Vout) U5.3(VIN) U7.8(VDD) U8.8(VDD) U9.8(VDD)
P12V: C11.2 C12.2 C15.2 C16.2 C17.2 C18.2 D3.2(A) D4.2(A) L3.2 R14.1 TP12.1 U1.1(VDD) U2.1(VDD) U4.3(Vin)
VIN+: C1.2 C2.2 C3.1 C4.1 CNT3.1 CNT3.2 CNT3.3 CNT3.4 D1.1(K) D10.2(A) Q1.5(D) Q1.6(D) Q1.7(D) Q1.8(D) Q1.9(D) R3.2 R17.1
VIN-: CNT5.1 CNT5.2 CNT5.3 CNT5.4 R7.1 R18.1 R23.1
ADC_Iin: C24.2 R26.1 U10.11(PA1)
ADC_Iout: C27.2 R36.1 U10.13(PA3)
ADC_VADJ: C30.2 R40.1 U10.14(PA4)
ADC_Vin: C23.2 R21.1 U10.10(PA0)
ADC_Vout: C26.2 R31.1 U10.12(PA2)
Gate1-H: D5.2(A) Q1.4(G) R1.2 R9.1 TP3.1
Gate1-L: D7.2(A) Q3.4(G) R5.2 R11.1 TP6.1
Gate2-H: D6.2(A) Q2.4(G) R2.2 R10.1 TP4.1
Gate2-L: D8.2(A) Q4.4(G) R6.2 R12.1 TP7.1
HS-1: C9.1 CNT1.1 CNT1.2 CNT1.3 CNT1.4 Q1.1(S) Q1.2(S) Q1.3(S) Q3.5(D) Q3.6(D) Q3.7(D) Q3.8(D) Q3.9(D) R1.1 TP1.1 U1.6(VS)
HS-2: C10.1 L1.2 L2.2 Q2.1(S) Q2.2(S) Q2.3(S) Q4.5(D) Q4.6(D) Q4.7(D) Q4.8(D) Q4.9(D) R2.1 TP2.1 U2.6(VS)
I2C1_SCL: U10.45(PB8)
I2C1_SDA: U10.46(PB9)
KEY1: C37.1 R46.2 SW1.1 SW1.2 U10.39(PB3)
KEY2: C38.1 R47.2 SW2.1 SW2.2 U10.40(PB4)
LED_G: R45.1 U10.18(PB0)
LED_R: R43.1 U10.20(PB2)
LED_Y: R44.1 U10.19(PB1)
PWM1H: U1.2(HIN) U10.29(PA8)
PWM1L: U1.3(LIN) U10.30(PA9)
PWM2H: U2.2(HIN) U10.31(PA10)
PWM2L: U2.3(LIN) U10.32(PA11)
SWCLK: H2.1 U10.37(PA14)
SWDIO: H2.2 U10.34(PA13)
USART1_RX: H1.3 U10.43(PB7)
USART1_TX: H1.2 U10.42(PB6)
VOUT+: C5.1 C6.1 C7.2 C8.2 CNT4.1 CNT4.2 CNT4.3 CNT4.4 D2.1(K) D9.2(A) Q2.5(D) Q2.6(D) Q2.7(D) Q2.8(D) Q2.9(D) R4.2 R27.1
VOUT-: CNT6.1 CNT6.2 CNT6.3 CNT6.4 R8.1 R28.1 R32.1
$1N2170: CNT2.1 CNT2.2 CNT2.3 CNT2.4 L1.1 L2.1
$1N3823: C9.2 D3.1(K) U1.8(VB)
$1N3972: D5.1(K) R9.2 U1.7(HO)
$1N4096: D7.1(K) R11.2 U1.5(LO)
$1N4511: C10.2 D4.1(K) U2.8(VB)
$1N4521: D6.1(K) R10.2 U2.7(HO)
$1N4534: D8.1(K) R12.2 U2.5(LO)
$2N358: C13.2 C14.2 D9.1(K) D10.1(K) U3.1(VIN)
$2N478: D11.1(K) L3.1 U3.2(SW)
$2N910: C17.1 R14.2 R15.1 U3.3(FB)
$2N1629: LED1.2(A) R16.2
$3N444: R17.2 R19.1 U7.3(+INA)
$3N584: R18.2 R20.2 U7.2(-INA)
$3N593: R20.1 R21.2 U7.1(OUTA)
$3N926: R22.2 R24.1 U7.5(+INB)
$3N1048: R23.2 R25.2 U7.6(-INB)
$3N1128: R25.1 R26.2 U7.7(OUTB)
$3N1682: R27.2 R29.1 U8.3(+INA)
$3N1693: R28.2 R30.2 U8.2(-INA)
$3N1698: R30.1 R31.2 U8.1(OUTA)
$3N1715: R32.2 R34.1 U8.5(+INB)
$3N1724: R33.2 R35.2 U8.6(-INB)
$3N1729: R35.1 R36.2 U8.7(OUTB)
$3N2221: C29.2 R37.1 R38.2 U9.3(+INA)
$3N2327: PR1.3 R39.2 R40.2
$4N871: R41.1 U10.44(BOOT0)
$4N978: C35.2 R42.1 U10.7(NRST)
$4N1109: LED2.2(A) R43.2
$4N1160: LED3.2(A) R44.2
$4N1211: LED4.2(A) R45.2

Not connected (* = marked no-connect by the designer): OLED1 1(GND) 2(VCC) 3(SCL) 4(SDA); TP8 1; TP9 1; TP10 1; TP11 1; U3 4(EN)*; U10 2(PC13) 3(PC14/OSC32_IN) 4(PC15/OSC32_OUT) 5(PF0/OSC_IN) 6(PF1/OSC_OUT) 15(PA5) 16(PA6) 17(PA7) 21(PB10) 22(PB11) 25(PB12) 26(PB13) 27(PB14) 28(PB15) 33(PA12)* 38(PA15) 41(PB5)
